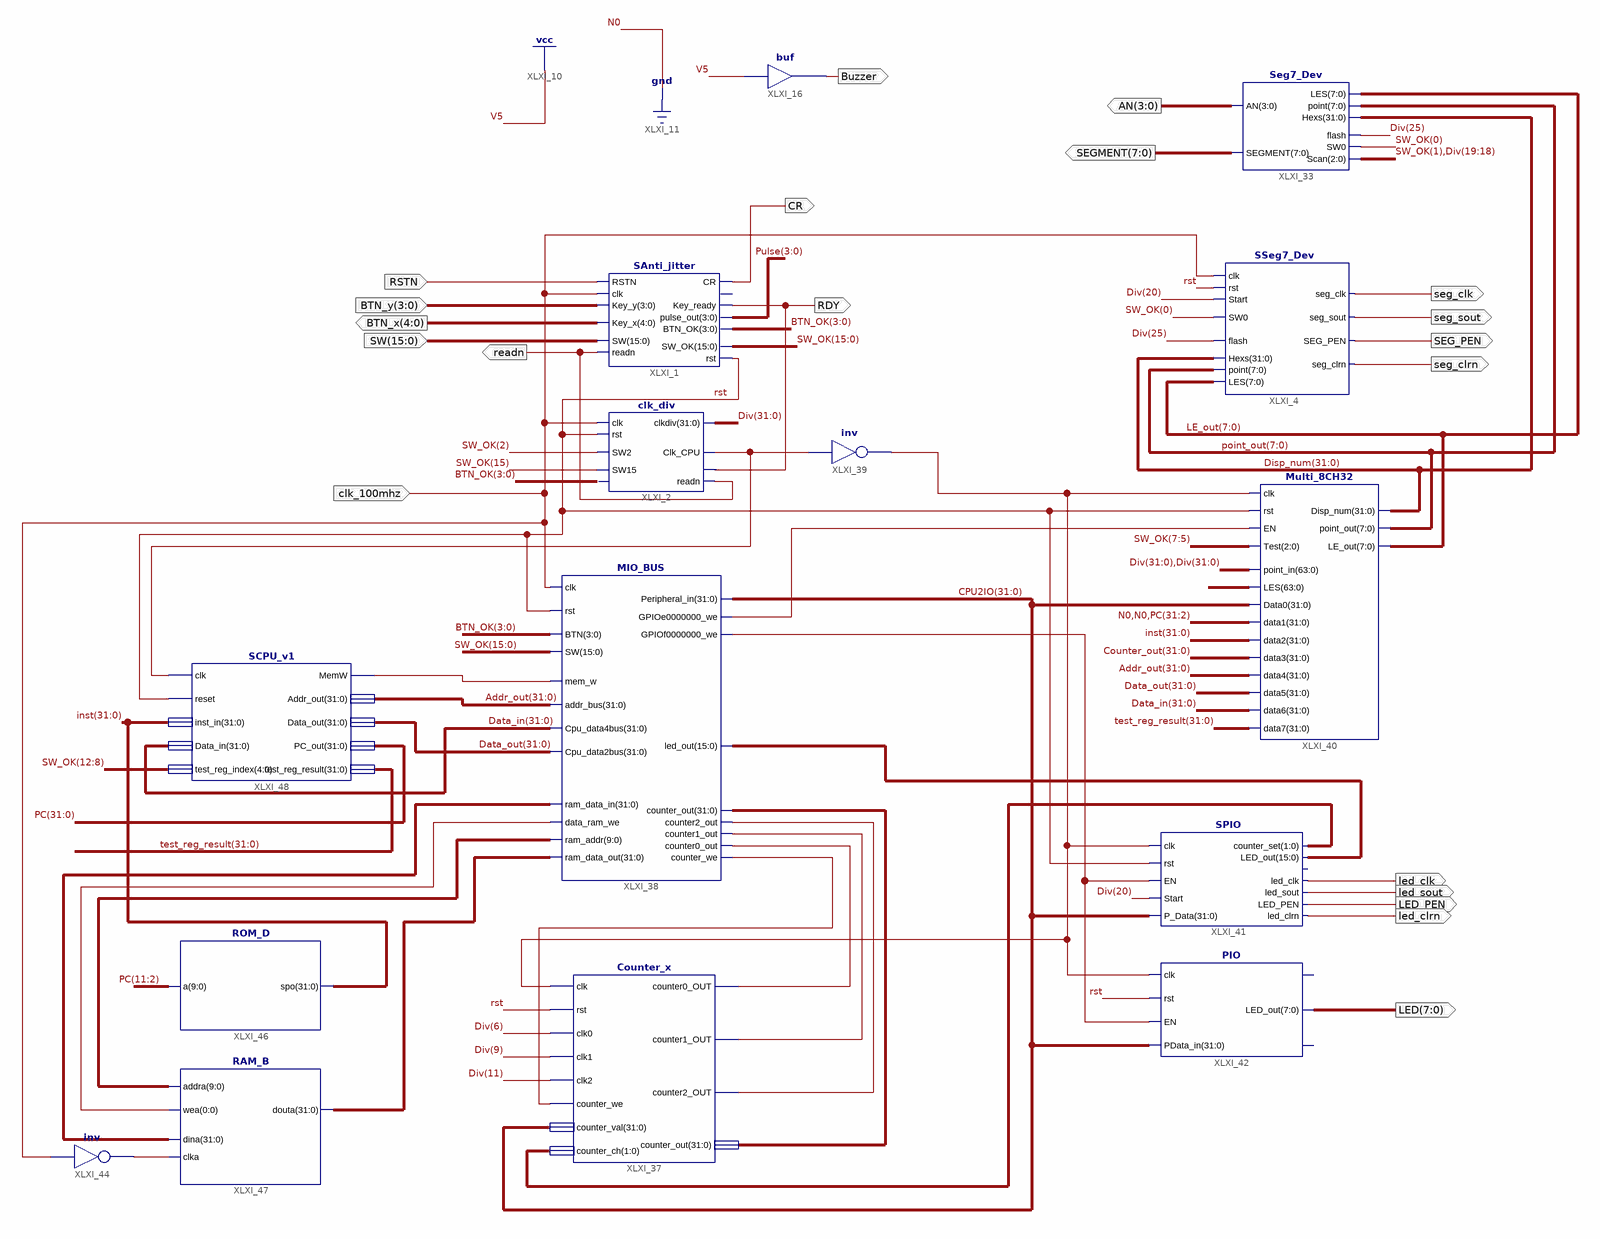
[diagram p0: schematic sheet 1]
// Xilinx ISE schematic OExp05_framework.sch (kintex7) as structural Verilog: 15 symbols, 20 ports
module OExp05_framework (
  input  RSTN,
  input  [3:0] BTN_y,
  input  [15:0] SW,
  input  clk_100mhz,
  output [4:0] BTN_x,
  output CR,
  output RDY,
  output seg_clk,
  output seg_sout,
  output SEG_PEN,
  output seg_clrn,
  output led_clk,
  output led_sout,
  output LED_PEN,
  output led_clrn,
  output [7:0] LED,
  output Buzzer,
  output [7:0] SEGMENT,
  output [3:0] AN,
  output readn
);

  wire Clk_CPU, IO_clk, rst, XLXN_145, XLXN_153, XLXN_178, XLXN_179, XLXN_180, XLXN_182, XLXN_188, XLXN_189;
  wire [0:0] XLXN_164;
  wire [1:0] XLXN_186;
  wire [3:0] BTN_OK, Pulse;
  wire [7:0] LE_out, point_out;
  wire [9:0] XLXN_168;
  wire [15:0] SW_OK, XLXN_192;
  wire [31:0] Addr_out, Counter_out, CPU2IO, Data_in, Data_out, Disp_num, Div, inst, PC, test_reg_result,
       XLXN_161, XLXN_170, XLXN_177;

  SAnti_jitter XLXI_1 (
    .SW(SW), .readn(readn), .Key_y(BTN_y), .Key_x(BTN_x), .RSTN(RSTN), .clk(clk_100mhz), .Key_ready(RDY),
    .CR(CR), .rst(rst), .SW_OK(SW_OK), .pulse_out(Pulse), .BTN_OK(BTN_OK));  // open: Key_out
  clk_div XLXI_2 (
    .rst(rst), .clk(clk_100mhz), .SW2(SW_OK[2]), .clkdiv(Div), .Clk_CPU(Clk_CPU), .SW15(SW_OK[15]),
    .BTN_OK(BTN_OK), .readn(readn), .keyReady(RDY));
  SSeg7_Dev XLXI_4 (
    .LES(LE_out), .SEG_PEN(SEG_PEN), .seg_sout(seg_sout), .seg_clrn(seg_clrn), .point(point_out),
    .Hexs(Disp_num), .SW0(SW_OK[0]), .flash(Div[25]), .seg_clk(seg_clk), .clk(clk_100mhz), .rst(rst),
    .Start(Div[20]));
  Seg7_Dev XLXI_33 (
    .LES(LE_out), .Scan({SW_OK[1], Div[19:18]}), .SEGMENT(SEGMENT), .AN(AN), .point(point_out),
    .flash(Div[25]), .SW0(SW_OK[0]), .Hexs(Disp_num));
  buf XLXI_16 (Buzzer, 1'b1);
  Counter_x XLXI_37 (
    .clk(IO_clk), .rst(rst), .clk0(Div[6]), .clk1(Div[9]), .clk2(Div[11]), .counter_we(XLXN_182),
    .counter_val(CPU2IO), .counter_ch(XLXN_186), .counter0_OUT(XLXN_180), .counter1_OUT(XLXN_179),
    .counter2_OUT(XLXN_178), .counter_out(XLXN_177));
  MIO_BUS XLXI_38 (
    .rst(rst), .clk(clk_100mhz), .mem_w(XLXN_153), .addr_bus(Addr_out), .Cpu_data4bus(Data_in),
    .Cpu_data2bus(Data_out), .ram_data_out(XLXN_170), .ram_addr(XLXN_168), .data_ram_we(XLXN_164[0]),
    .ram_data_in(XLXN_161), .counter_out(XLXN_177), .counter2_out(XLXN_178), .counter1_out(XLXN_179),
    .counter0_out(XLXN_180), .counter_we(XLXN_182), .BTN(BTN_OK), .SW(SW_OK), .led_out(XLXN_192),
    .Peripheral_in(CPU2IO), .GPIOe0000000_we(XLXN_188), .GPIOf0000000_we(XLXN_189));
  not XLXI_39 (IO_clk, Clk_CPU);
  Multi_8CH32 XLXI_40 (
    .Test(SW_OK[7:5]), .point_in({Div, Div}), .EN(XLXN_188), .clk(IO_clk), .rst(rst), .LES({64{1'b0}}),
    .Data0(CPU2IO), .data1({2'b00, PC[31:2]}), .data2(inst), .data3(Counter_out), .data4(Addr_out),
    .data5(Data_out), .data6(Data_in), .data7(test_reg_result), .point_out(point_out), .LE_out(LE_out),
    .Disp_num(Disp_num));
  SPIO XLXI_41 (
    .clk(IO_clk), .P_Data(CPU2IO), .rst(rst), .EN(XLXN_189), .Start(Div[20]), .led_clk(led_clk),
    .LED_out(XLXN_192), .counter_set(XLXN_186), .led_clrn(led_clrn), .LED_PEN(LED_PEN), .led_sout(led_sout));  // open: GPIOf0
  PIO XLXI_42 (.clk(IO_clk), .rst(rst), .EN(XLXN_189), .PData_in(CPU2IO), .LED_out(LED));  // open: GPIOf0, counter_set
  not XLXI_44 (XLXN_145, clk_100mhz);
  ROM_D XLXI_46 (.a(PC[11:2]), .spo(inst));
  RAM_B XLXI_47 (.addra(XLXN_168), .clka(XLXN_145), .wea(XLXN_164[0]), .dina(XLXN_161), .douta(XLXN_170));
  SCPU_v1 XLXI_48 (
    .clk(Clk_CPU), .reset(rst), .inst_in(inst), .Data_in(Data_in), .test_reg_index(SW_OK[12:8]),
    .MemW(XLXN_153), .Addr_out(Addr_out), .Data_out(Data_out), .PC_out(PC), .test_reg_result(test_reg_result));
endmodule
